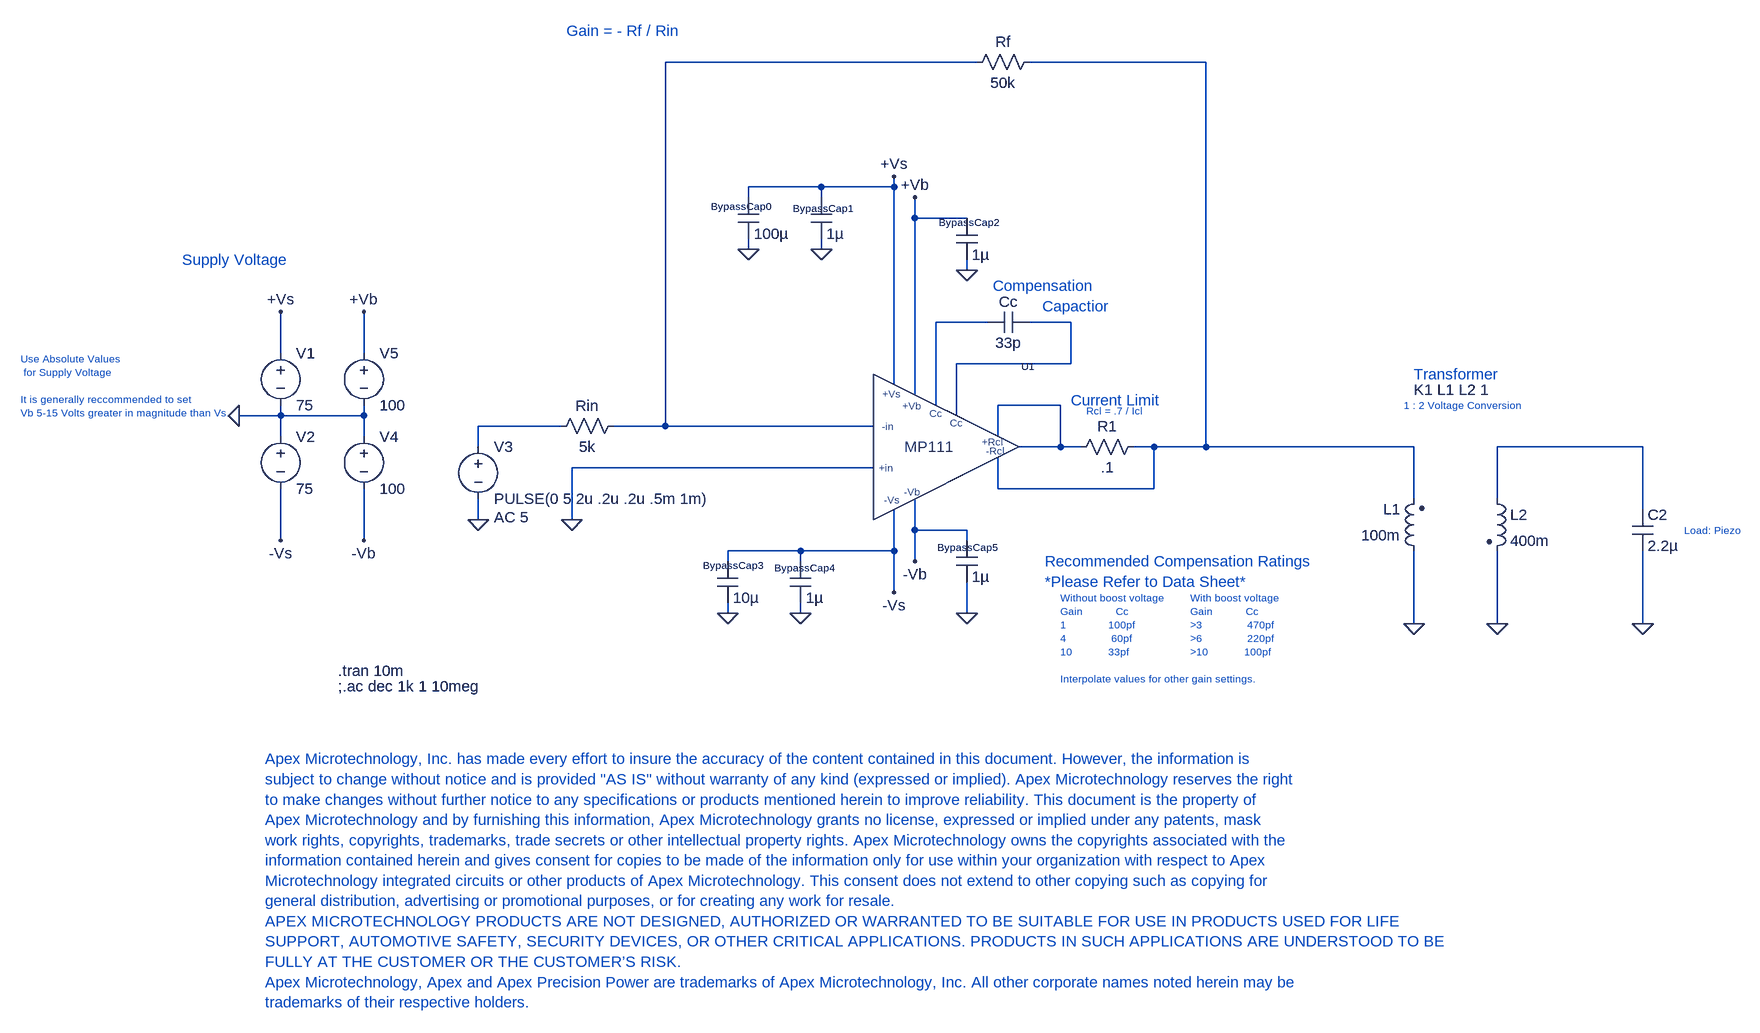
[diagram p0: schematic MP111.asc]
MP111.asc, the LTspice schematic file:
Version 4
SHEET 1 2088 976
WIRE 800 -448 320 -448
WIRE 1152 -448 880 -448
WIRE 560 -256 448 -256
WIRE 672 -256 672 -272
WIRE 672 -256 560 -256
WIRE 448 -240 448 -256
WIRE 560 -240 560 -256
WIRE 704 -208 704 -240
WIRE 784 -208 704 -208
WIRE 448 -160 448 -176
WIRE 560 -160 560 -176
WIRE 784 -128 784 -144
WIRE 816 -48 736 -48
WIRE 944 -48 880 -48
WIRE -272 0 -272 -64
WIRE -144 0 -144 -64
WIRE 944 16 944 -48
WIRE 944 16 768 16
WIRE 672 48 672 -256
WIRE 704 64 704 -208
WIRE 736 80 736 -48
WIRE 928 80 832 80
WIRE -272 96 -272 80
WIRE -272 96 -336 96
WIRE -144 96 -144 80
WIRE -144 96 -272 96
WIRE 768 96 768 16
WIRE 160 112 32 112
WIRE 320 112 320 -448
WIRE 320 112 240 112
WIRE 640 112 320 112
WIRE -272 128 -272 96
WIRE -144 128 -144 96
WIRE 832 128 832 80
WIRE 32 144 32 112
WIRE 928 144 928 80
WIRE 928 144 864 144
WIRE 960 144 928 144
WIRE 1072 144 1040 144
WIRE 1152 144 1152 -448
WIRE 1152 144 1072 144
WIRE 1472 144 1152 144
WIRE 1824 144 1600 144
WIRE 640 176 176 176
WIRE 832 208 832 160
WIRE 1072 208 1072 144
WIRE 1072 208 832 208
WIRE 1472 224 1472 144
WIRE 1600 224 1600 144
WIRE 1824 240 1824 144
WIRE 32 256 32 224
WIRE 176 256 176 176
WIRE 704 272 704 224
WIRE 784 272 704 272
WIRE -272 288 -272 208
WIRE -144 288 -144 208
WIRE 784 288 784 272
WIRE 528 304 416 304
WIRE 672 304 672 240
WIRE 672 304 528 304
WIRE 416 320 416 304
WIRE 528 320 528 304
WIRE 704 320 704 272
WIRE 672 368 672 304
WIRE 416 400 416 384
WIRE 528 400 528 384
WIRE 784 400 784 352
WIRE 1472 416 1472 304
WIRE 1600 416 1600 304
WIRE 1824 416 1824 304
FLAG -336 96 0
FLAG -272 -64 +Vs
FLAG -272 288 -Vs
FLAG 176 256 0
FLAG 32 256 0
FLAG -144 -64 +Vb
FLAG 704 -240 +Vb
FLAG -144 288 -Vb
FLAG 704 320 -Vb
FLAG 672 -272 +Vs
FLAG 672 368 -Vs
FLAG 1472 416 0
FLAG 1600 416 0
FLAG 1824 416 0
FLAG 448 -160 0
FLAG 560 -160 0
FLAG 784 -128 0
FLAG 416 400 0
FLAG 528 400 0
FLAG 784 400 0
SYMBOL voltage -272 -16 R0
WINDOW 123 0 0 Left 0
WINDOW 39 0 0 Left 0
SYMATTR InstName V1
SYMATTR Value 75
SYMBOL voltage -272 112 R0
WINDOW 123 0 0 Left 0
WINDOW 39 0 0 Left 0
SYMATTR InstName V2
SYMATTR Value 75
SYMBOL voltage 32 128 R0
WINDOW 123 24 124 Left 2
WINDOW 39 0 0 Left 0
SYMATTR Value2 AC 5
SYMATTR InstName V3
SYMATTR Value PULSE(0 5 2u .2u .2u .5m 1m)
SYMBOL res 256 96 R90
WINDOW 0 0 56 VBottom 2
WINDOW 3 32 56 VTop 2
SYMATTR InstName Rin
SYMATTR Value 5k
SYMBOL cap 880 -64 R90
WINDOW 0 0 32 VBottom 2
WINDOW 3 32 32 VTop 2
SYMATTR InstName Cc
SYMATTR Value 33p
SYMBOL voltage -144 112 R0
WINDOW 123 0 0 Left 0
WINDOW 39 0 0 Left 0
SYMATTR InstName V4
SYMATTR Value 100
SYMBOL voltage -144 -16 R0
WINDOW 123 0 0 Left 0
WINDOW 39 0 0 Left 0
SYMATTR InstName V5
SYMATTR Value 100
SYMBOL res 896 -464 R90
WINDOW 0 0 56 VBottom 2
WINDOW 3 32 56 VTop 2
SYMATTR InstName Rf
SYMATTR Value 50k
SYMBOL ind2 1488 320 R180
WINDOW 0 36 80 Left 2
WINDOW 3 36 40 Left 2
SYMATTR InstName L1
SYMATTR Value 100m
SYMATTR Type ind
SYMATTR SpiceLine Rser=2
SYMBOL ind2 1584 208 R0
SYMATTR InstName L2
SYMATTR Value 400m
SYMATTR Type ind
SYMATTR SpiceLine Rser=2
SYMBOL cap 1808 240 R0
SYMATTR InstName C2
SYMATTR Value 2.2µ
SYMBOL OpAmps\\MP111 656 144 R0
SYMATTR InstName U1
SYMBOL cap 432 -240 R0
WINDOW 0 -42 14 Left 1
SYMATTR InstName BypassCap0
SYMATTR Value 100µ
SYMBOL cap 544 -240 R0
WINDOW 0 -28 17 Left 1
SYMATTR InstName BypassCap1
SYMATTR Value 1µ
SYMBOL cap 768 -208 R0
WINDOW 0 -27 6 Left 1
SYMATTR InstName BypassCap2
SYMATTR Value 1µ
SYMBOL cap 768 288 R0
WINDOW 0 -29 10 Left 1
SYMATTR InstName BypassCap5
SYMATTR Value 1µ
SYMBOL cap 512 320 R0
WINDOW 0 -24 10 Left 1
SYMATTR InstName BypassCap4
SYMATTR Value 1µ
SYMBOL cap 400 320 R0
WINDOW 0 -22 6 Left 1
SYMATTR InstName BypassCap3
SYMATTR Value 10µ
SYMBOL res 1056 128 R90
WINDOW 0 0 56 VBottom 2
WINDOW 3 32 56 VTop 2
SYMATTR InstName R1
SYMATTR Value .1
TEXT -184 488 Left 2 !.tran 10m
TEXT 1472 56 Left 2 !K1 L1 L2 1
TEXT -184 512 Left 2 !;.ac dec 1k 1 10meg
TEXT -296 624 Left 2 ;Apex Microtechnology, Inc. has made every effort to insure the accuracy of the content contained in this document. However, the information is\nsubject to change without notice and is provided "AS IS" without warranty of any kind (expressed or implied). Apex Microtechnology reserves the right\nto make changes without further notice to any specifications or products mentioned herein to improve reliability. This document is the property of\nApex Microtechnology and by furnishing this information, Apex Microtechnology grants no license, expressed or implied under any patents, mask\nwork rights, copyrights, trademarks, trade secrets or other intellectual property rights. Apex Microtechnology owns the copyrights associated with the\ninformation contained herein and gives consent for copies to be made of the information only for use within your organization with respect to Apex\nMicrotechnology integrated circuits or other products of Apex Microtechnology. This consent does not extend to other copying such as copying for\ngeneral distribution, advertising or promotional purposes, or for creating any work for resale. \nAPEX MICROTECHNOLOGY PRODUCTS ARE NOT DESIGNED, AUTHORIZED OR WARRANTED TO BE SUITABLE FOR USE IN PRODUCTS USED FOR LIFE\nSUPPORT, AUTOMOTIVE SAFETY, SECURITY DEVICES, OR OTHER CRITICAL APPLICATIONS. PRODUCTS IN SUCH APPLICATIONS ARE UNDERSTOOD TO BE\nFULLY AT THE CUSTOMER OR THE CUSTOMER’S RISK. \nApex Microtechnology, Apex and Apex Precision Power are trademarks of Apex Microtechnology, Inc. All other corporate names noted herein may be\ntrademarks of their respective holders.
TEXT -672 8 Left 1 ;Use Absolute Values\n for Supply Voltage\n \nIt is generally reccommended to set\nVb 5-15 Volts greater in magnitude than Vs.
TEXT -424 -144 Left 2 ;Supply Voltage
TEXT 168 -496 Left 2 ;Gain = - Rf / Rin
TEXT 1472 32 Left 2 ;Transformer
TEXT 1456 80 Left 1 ;1 : 2 Voltage Conversion
TEXT 1888 272 Left 1 ;Load: Piezo
TEXT 944 72 Left 2 ;Current Limit
TEXT 968 88 Left 1 ;Rcl = .7 / Icl
TEXT 824 -104 Left 2 ;Compensation\n           Capactior
TEXT 928 376 Left 1 ;Without boost voltage\nGain           Cc\n1              100pf \n4               60pf\n10            33pf\n \nInterpolate values for other gain settings.
TEXT 904 320 Left 2 ;Recommended Compensation Ratings\n*Please Refer to Data Sheet*
TEXT 1128 376 Left 1 ;With boost voltage\nGain           Cc\n>3               470pf \n>6               220pf\n>10            100pf

The netlist it stands for:
* MP111.asc
V1 +Vs 0 75
V2 0 -Vs 75
V3 N006 0 PULSE(0 5 2u .2u .2u .5m 1m) AC 5
Rin N001 N006 5k
Cc N004 N003 33p
V4 0 -Vb 100
V5 +Vb 0 100
Rf N002 N001 50k
L1 0 N002 100m Rser=2
L2 N007 0 400m Rser=2
C2 N007 0 2.2µ
XU1 0 N001 N005 N002 N005 +Vb -Vb N003 N004 +Vs -Vs MP111 MP111  ; pins +in -in +Rcl -Rcl out +Vb -Vb Cc1 Cc2 +Vs -Vs
C§BypassCap0 +Vs 0 100µ
C§BypassCap1 +Vs 0 1µ
C§BypassCap2 +Vb 0 1µ
C§BypassCap5 -Vb 0 1µ
C§BypassCap4 -Vs 0 1µ
C§BypassCap3 -Vs 0 10µ
R1 N002 N005 .1
.tran 10m
K1 L1 L2 1
;.ac dec 1k 1 10meg
* Apex Microtechnology, Inc. has made every effort to insure the accuracy of the content contained in this document. However, the information is
* subject to change without notice and is provided "AS IS" without warranty of any kind (expressed or implied). Apex Microtechnology reserves the right
* to make changes without further notice to any specifications or products mentioned herein to improve reliability. This document is the property of
* Apex Microtechnology and by furnishing this information, Apex Microtechnology grants no license, expressed or implied under any patents, mask
* work rights, copyrights, trademarks, trade secrets or other intellectual property rights. Apex Microtechnology owns the copyrights associated with the
* information contained herein and gives consent for copies to be made of the information only for use within your organization with respect to Apex
* Microtechnology integrated circuits or other products of Apex Microtechnology. This consent does not extend to other copying such as copying for
* general distribution, advertising or promotional purposes, or for creating any work for resale.
* APEX MICROTECHNOLOGY PRODUCTS ARE NOT DESIGNED, AUTHORIZED OR WARRANTED TO BE SUITABLE FOR USE IN PRODUCTS USED FOR LIFE
* SUPPORT, AUTOMOTIVE SAFETY, SECURITY DEVICES, OR OTHER CRITICAL APPLICATIONS. PRODUCTS IN SUCH APPLICATIONS ARE UNDERSTOOD TO BE
* FULLY AT THE CUSTOMER OR THE CUSTOMER’S RISK.
* Apex Microtechnology, Apex and Apex Precision Power are trademarks of Apex Microtechnology, Inc. All other corporate names noted herein may be
* trademarks of their respective holders.
* Use Absolute Values
*  for Supply Voltage
* It is generally reccommended to set
* Vb 5-15 Volts greater in magnitude than Vs.
* Supply Voltage
* Gain = - Rf / Rin
* Transformer
* 1 : 2 Voltage Conversion
* Load: Piezo
* Current Limit
* Rcl = .7 / Icl
* Compensation
*            Capactior
* Without boost voltage
* Gain           Cc
* 1              100pf
* 4               60pf
* 10            33pf
* Interpolate values for other gain settings.
* Recommended Compensation Ratings
* *Please Refer to Data Sheet*
* With boost voltage
* Gain           Cc
* >3               470pf
* >6               220pf
* >10            100pf
.lib MP111.lib
.backanno
.end